# EAGLE design rapidshark-clip-detector-mk-1.0 (EAGLE 6.5.0)
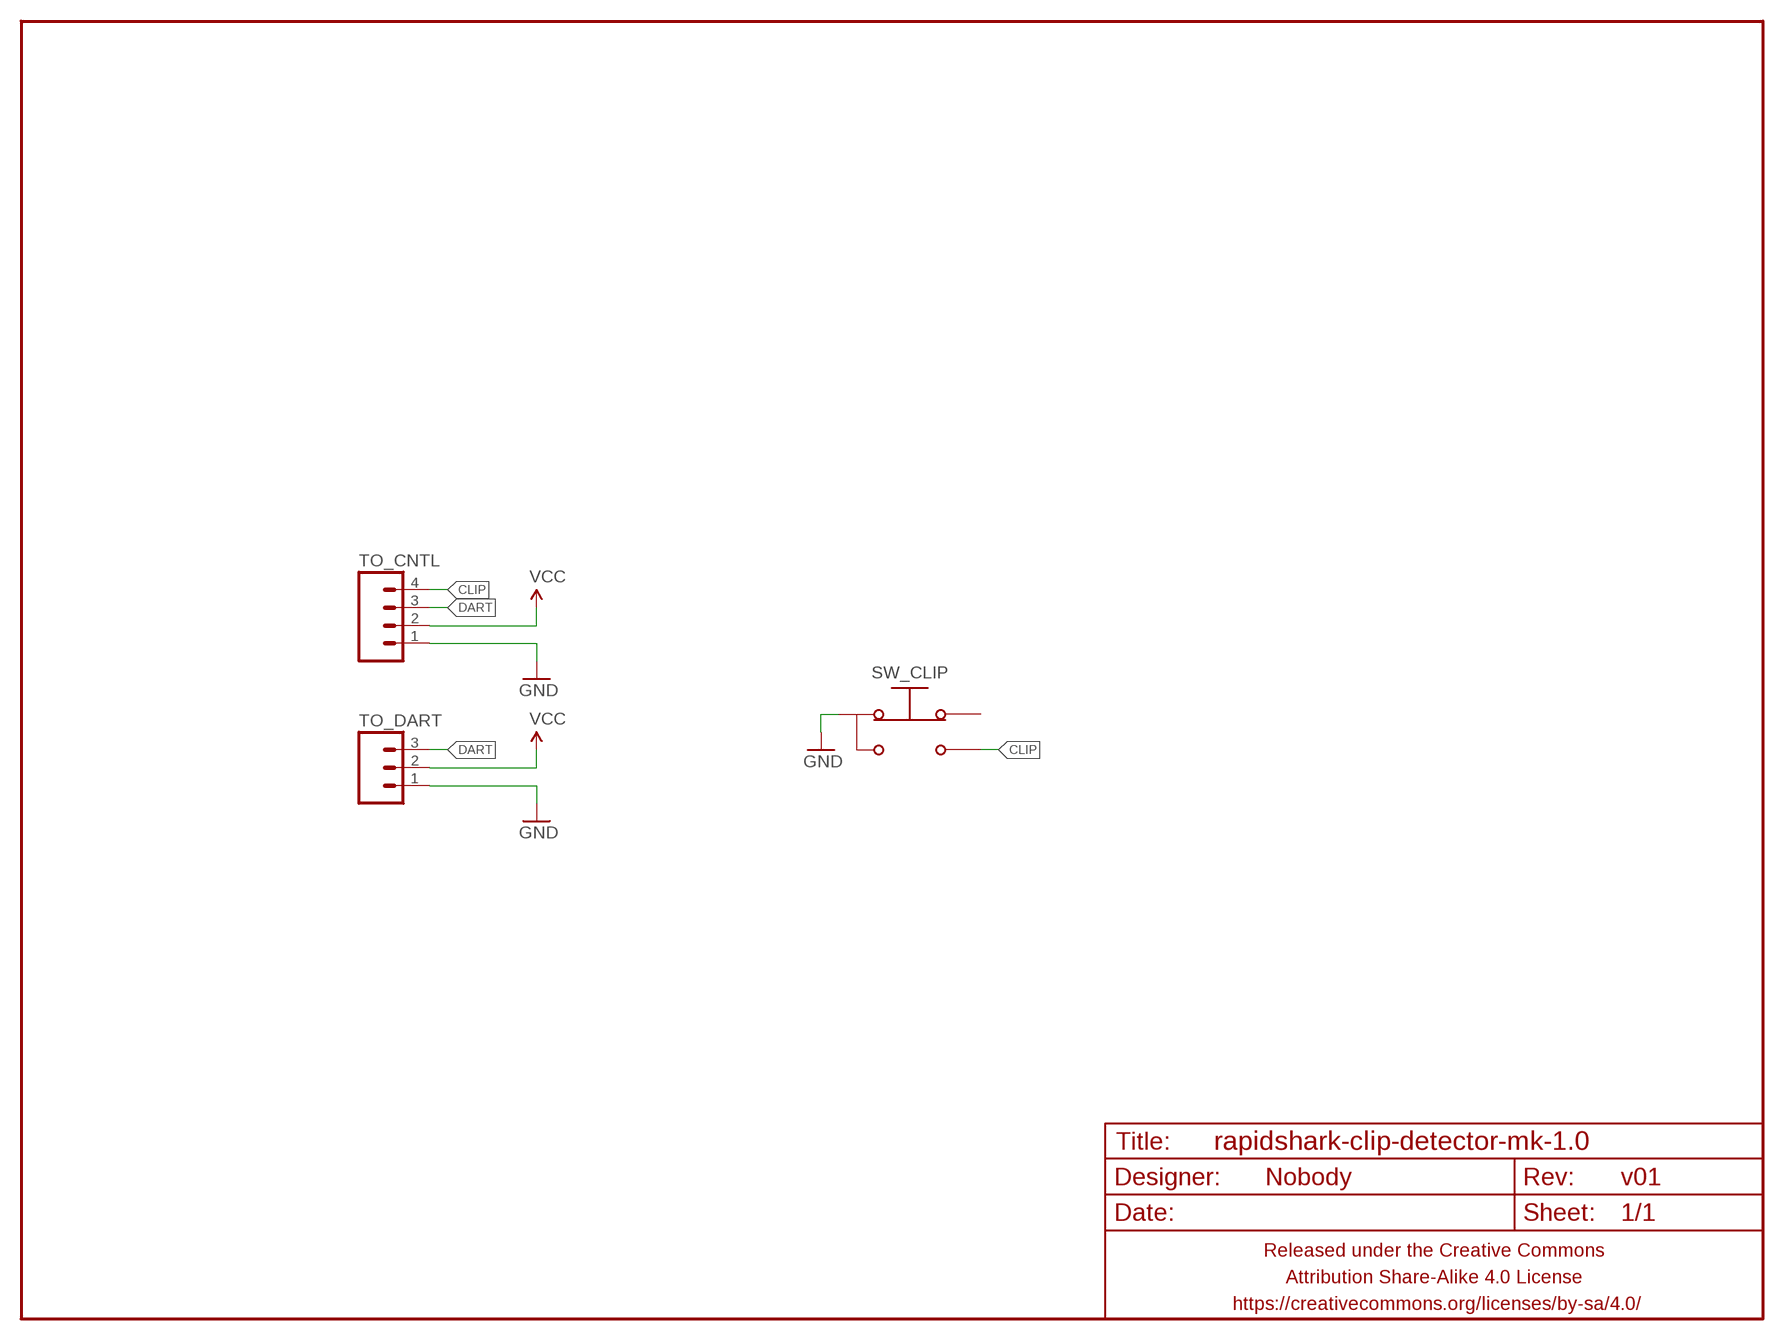
[diagram p0: schematic, sheet 1]

## Parts
FRAME1  FRAME-LETTERNO_PACKAGE  [DUMMY]
SW_CLIP  SPDT-NO-TACTPTH-RA-DETECT-3MM  [SWITCH-DETECH-SPDT-3MM]
TO_CNTL  M04JST-PTH-VERT  [JST-4-PH-VERT-PTH]
TO_DART  M03JST-PTH-VERT  [JST-3-PH-VERT-PTH]

## Nets
CLIP: SW_CLIP.3(NO) TO_CNTL.4
DART: TO_CNTL.3 TO_DART.3
GND: SW_CLIP.2(COM) TO_CNTL.1 TO_DART.1
VCC: TO_CNTL.2 TO_DART.2
Unconnected: SW_CLIP.1(NC)

## Library data of the parts
FRAME1 = A_butts:FRAME-LETTER: Schematic Frame Standard 8.5x11 US Letter frame; DESIGNER: Nobody; VERSION: v01
SW_CLIP = A_butts:SPDT-NO-TACT
TO_CNTL = A_butts:M04: Header 4 Standard 4-pin 0.1" header. Use with straight break away headers (SKU : PRT-00116), right angle break away headers (PRT-00553), swiss pins (PRT-00743), machine pins (PRT-00117), and female headers (PRT-00115). Molex polarized connector foot print use with SKU : PRT-08231 with associated crimp pins and housings. 1MM SMD Version SKU: PRT-10208
TO_DART = A_butts:M03: Header 3 Standard 3-pin 0.1" header. Use with straight break away headers (SKU : PRT-00116), right angle break away headers (PRT-00553), swiss pins (PRT-00743), machine pins (PRT-00117), and female headers (PRT-00115). Molex polarized connector foot print use with SKU : PRT-08232 with associated crimp pins and housings.

## Board
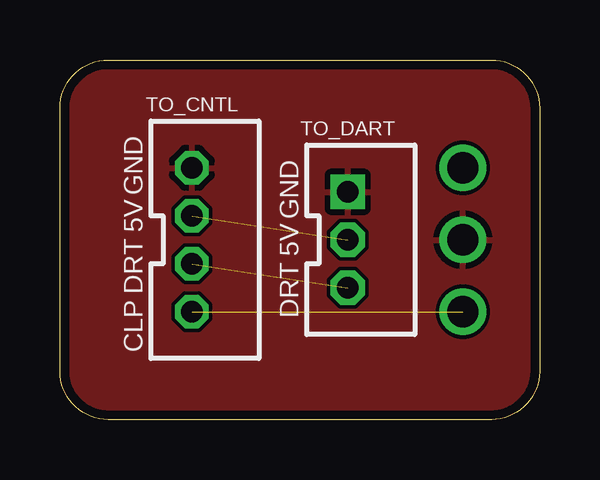
[diagram p1: board, top side]
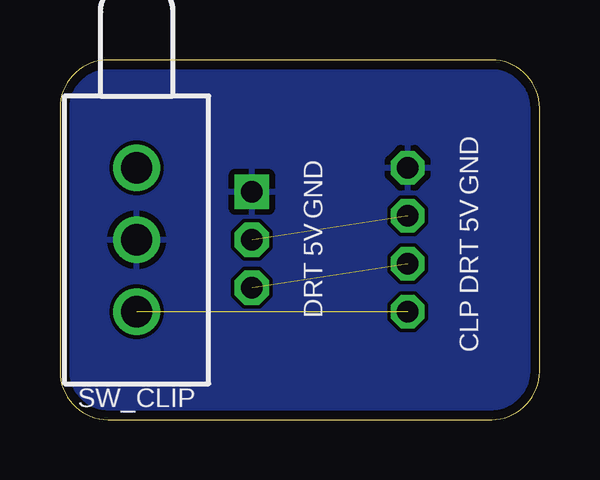
[diagram p2: board, bottom side, seen from below]

Size 20 x 15 mm. Coordinates in mm from the lower left corner, seen from the top.
Outline: 18,0 2,0 arc-90 0,2 0,13 arc-90 2,15 18,15 arc-90 20,13 20,2 arc-90 18,0
Copper layers (1*16): Top 0.0356mm / dielectric 1.5011mm / Bottom 0.0356mm
Design rules "LaenPCBOrder_2": minimum track width 6mil, minimum drill 13mil, track to track 6mil, track to pad 6mil, pad to pad 6mil, via to via 6mil, smd to smd 6mil, copper to edge 15mil, drill to drill 6mil, minimum pad ring 7mil, minimum via ring 7mil, stop-mask expansion 3mil, vias tented up to drill 20mil, thermal gap 10mil

### Footprints (pad centres in the part's own frame; a part is rotated, then mirrored left to right if it is on the bottom)
SWITCH-DETECH-SPDT-3MM = drill 1.3 pad 1.88: 1 0,3; 2 0,0; 3 0,-3
JST-4-PH-VERT-PTH = drill 0.9 pad 1.4 octagon: 1 0,0; 2 2,0; 3 4,0; 4 6,0
JST-3-PH-VERT-PTH = drill 0.9 pad 1.422 square: 1 0,0 | drill 0.9 pad 1.422 octagon: 2 2,0; 3 4,0

### Placement (x,y rotation side)
FRAME1  0,0 180 bottom
SW_CLIP  16.8,7.5 0 bottom
TO_CNTL  5.5,10.5 270 top
TO_DART  12,9.5 270 top

### Tracks (layer width: path | path; a pad name or v marks a point on that pad's centre or on a via)
CLIP  (1 unrouted)
DART  (1 unrouted)
GND
  pour Top (rank 5): 0,15 0,0 20,0 20,15
  pour Bottom (rank 5): 20,15 0,15 0,0 20,0
VCC  (1 unrouted)

### Text on the board
tPlace: GND | GND | 5V | 5V | DRT | DRT | CLP
bPlace: GND | GND | 5V | 5V | DRT | DRT | CLP